# Altium project TK518_P18V-PSU.PrjPcb
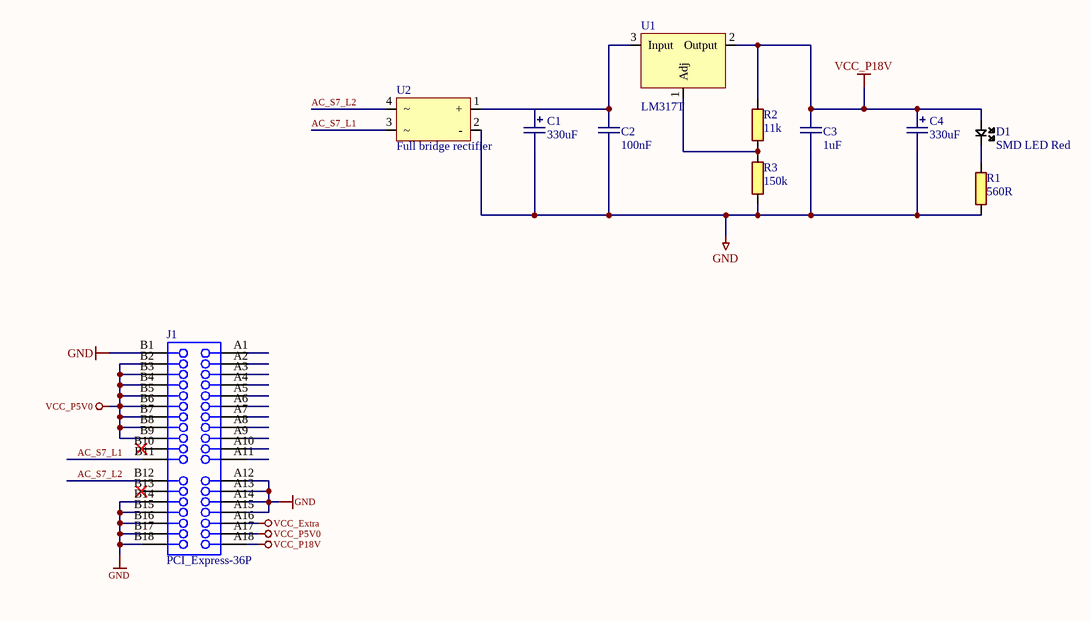
[diagram p0: TK518_P18V-PSU.SchDoc]
1 sheet, 11 parts. Net scope: global (net labels, ports and power ports of the same name join across sheets).
Board file: TK518_P18V-PSU.PcbDoc

## Sheet TK518_P18V-PSU.SchDoc: TK517 P5V0-PSU
size A3; Organization: Omega Verksted; DocumentNumber: 10; Revision: 0; SheetNumber: 10; SheetTotal: 20

### Parts
C1  330uF  [CAPPR35D08H16]
C2  100nF  [CAPC0603(1608)55_N]
C3  1uF  [CAPC0805(2012)100_N]
C4  330uF  [CAPPR35D08H16]
D1  SMD LED Red  [I_LEDC0603(1608)_N]
J1  PCI_Express-36P  [PCIeX1-GF-2D-1000-1K-O36]
R1  560R  [RESC0603(1608)_N]
R2  11k  [RESC0603(1608)_N]
R3  150k  [RESC0603(1608)_N]
U1  LM317T  [TO-220-3P]
U2  Full bridge rectifier  [SOP500P1010X260-4N]

### Nets
GND: C1.1 C2.1 C3.1 C4.1 J1.A12 J1.A13 J1.A14 J1.A15 J1.B1 J1.B14 J1.B15 J1.B16 J1.B17 J1.B18 R1.1 R3.1 U2.2(-)
VCC_Extra: J1.A16
VCC_P5V0: J1.A17 J1.B2 J1.B3 J1.B4 J1.B5 J1.B6 J1.B7 J1.B8 J1.B9
VCC_P18V: C3.2 C4.2 D1.1 J1.A18 R2.2 U1.2(Output)
AC_S7_L1: J1.B11 U2.3
AC_S7_L2: J1.B12 U2.4
NetC1_2: C1.2 C2.2 U1.3(Input) U2.1(+)
NetD1_2: D1.2 R1.2
NetR2_1: R2.1 R3.2 U1.1(Adj)

Not connected (* = marked no-connect by the designer): J1 A1 A2 A3 A4 A5 A6 A7 A8 A9 A10 A11 B10* B13*

### Notes on the sheet
- Size:
- Date:
- Title:
- A3
- Revision:
- Sheet
- of
- Author:
- File:

### Library data of the parts
C1 C4 = 3891: 25V elektrolytt; id: 3891; pakke_opprettet_av: 1335; pakke_opprettet: 13.11.2016 14.32.40; symbol_opprettet_av: 815; symbol_opprettet: 28.06.2014 15.26.13; leverandor_varenr: 2346202; pris: 0; produsent: Rubycon; leverandor: Farnell; pakketype: TH; navn: 330uF
C2 = 3028: X7R 50V 5%; id: 3028; pakke_opprettet_av: 815; pakke_opprettet: 18.02.2015 14.18.13; symbol_opprettet: 14.11.2014 20.19.34; leverandor_varenr: 1759122; pris: 1; nokkelord: Kondensator, Capacitor, CAP; produsent: Multikomp; leverandor: Farnell; pakketype: 0603; symbol_opprettet_av: 815; navn: 100nF
C3 = 3582: X7R 50V 10%; id: 3582; pakke_opprettet_av: 815; pakke_opprettet: 14.11.2014 20.52.01; symbol_opprettet: 14.11.2014 20.19.34; leverandor_varenr: 1735541; pris: 4; nokkelord: Kondensator, capacitor; produsent: Murata; leverandor: Farnell; pakketype: 0805; symbol_opprettet_av: 815; navn: 1uF
D1 = 2209: id: 2209; rad: 0; rom: OV; lager_type: Fremlager; dybde: 2; hylle: 13; antall: 50; pakke_opprettet_av: 815; pakke_opprettet: 06.07.2014 18.55.44; symbol_opprettet: 06.07.2014 18.59.47; leverandor_varenr: 8554641; pris: 1; produsent: Avago; leverandor: Farnell; pakketype: 0603; kolonne: 0; symbol_opprettet_av: 815; beskrivelse: SMD; navn: SMD LED Red; nokkelord: SMD
J1 = 3177: PCI express PCB kortkankonnektor; id: 3177; pakke_opprettet_av: 815; pakke_opprettet: 07.06.2015 17.49.10; symbol_opprettet: 06.07.2014 17.26.37; pris: 0; symbol_opprettet_av: 815; navn: PCIeX1-GF-2D-1000-1K-O36; pakketype: -
R1 = 3435: 0.1W 1% Thick film resistor; id: 3435; rad: -1; rom: OV; lager_type: Fremlager; dybde: 42; hylle: 6; antall: 100; kolonne: 0; pakke_opprettet_av: 815; pakke_opprettet: 08.07.2014 21.15.30; symbol_opprettet: 08.07.2014 21.16.33; pakketype: 0603; symbol_opprettet_av: 815; navn: 560R; pris: 0
R2 = 3465: 0.1W 1% Thick film resistor; id: 3465; rad: -1; rom: OV; lager_type: Fremlager; dybde: 73; hylle: 6; antall: 100; kolonne: 0; pakke_opprettet_av: 815; pakke_opprettet: 08.07.2014 21.15.30; symbol_opprettet: 08.07.2014 21.16.33; pakketype: 0603; symbol_opprettet_av: 815; navn: 11k; pris: 0
R3 = 3493: 0.1W 1% Thick film resistor; id: 3493; rad: -1; rom: OV; lager_type: Fremlager; dybde: 100; hylle: 6; kolonne: 0; pakke_opprettet_av: 815; pakke_opprettet: 08.07.2014 21.15.30; symbol_opprettet: 08.07.2014 21.16.33; pakketype: 0603; antall: 100; symbol_opprettet_av: 815; navn: 150k; pris: 0
U1 = LM317T: Adjustable Regulator
U2 = DBLS07G Rectifier: farnell: 1299301